# EAGLE schematic turbo_jumper (EAGLE 9.6.2)
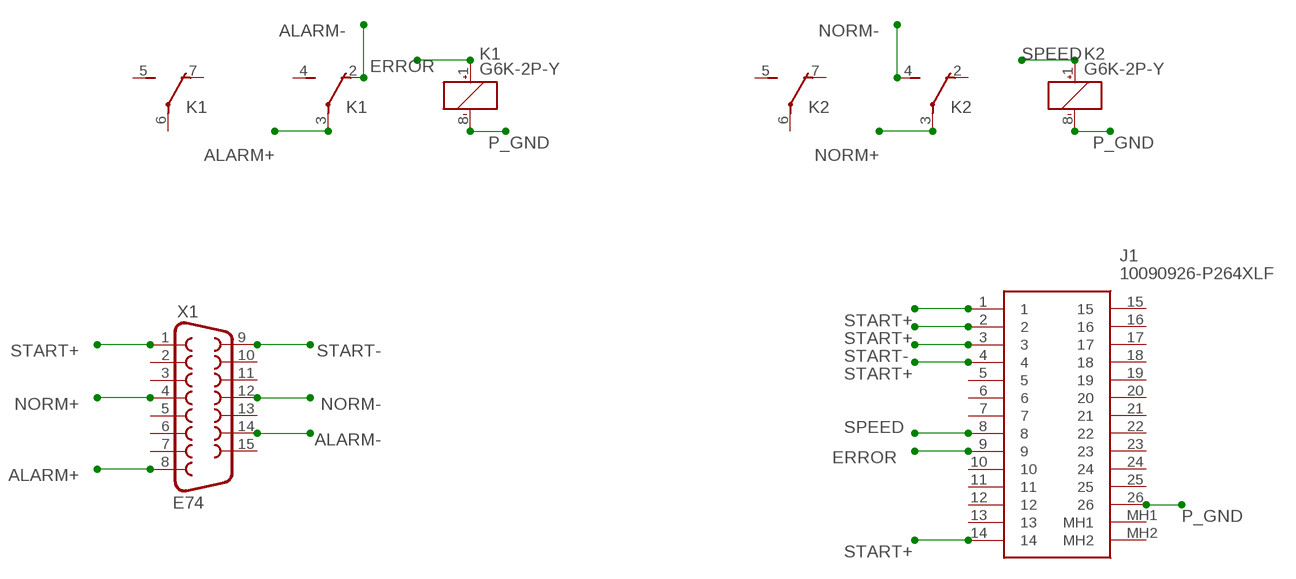
[diagram p0: schematic, sheet 1]

## Parts
J1  10090926-P264XLF  [10090926P264XLF]
K1  G6K-2P-Y  [G6K-2P-Y]
K2  G6K-2P-Y  [G6K-2P-Y]
X1  E74  F15VP  [F15VP]

## Nets
ALARM+: K1.3(2:P) X1.8
ALARM-: K1.2(2:O) X1.14
ERROR: J1.9 K1.1(1:+)
NORM+: K2.3(2:P) X1.4
NORM-: K2.4(2:S) X1.12
P_GND: J1.26 K1.8(1:-) K2.8(1:-)
SPEED: J1.8 K2.1(1:+)
START+: J1.1 J1.2 J1.4 J1.14 X1.1
START-: J1.3 X1.9
Unconnected: J1.5 J1.6 J1.7 J1.10 J1.11 J1.12 J1.13 J1.15 J1.16 J1.17 J1.18 J1.19 J1.20 J1.21 J1.22 J1.23 J1.24 J1.25 J1.MH1 J1.MH2 K1.4(2:S) K1.5(3:S) K1.6(3:P) K1.7(3:O) K2.2(2:O) K2.5(3:S) K2.6(3:P) K2.7(3:O) X1.2 X1.3 X1.5 X1.6 X1.7 X1.10 X1.11 X1.13 X1.15

## Library data of the parts
J1 = 10090926-P264XLF:10090926-P264XLF: 26 Position D-Sub, High Density Plug, Male Pins Connector Source: Datasheet <https://cdn.amphenol-cs.com/media/wysiwyg/files/drawing/10090926.pdf>; DESCRIPTION: 26 Position D-Sub, High Density Plug, Male Pins Connector; HEIGHT: 12.8mm; MANUFACTURER_NAME: Amphenol; MANUFACTURER_PART_NUMBER: 10090926-P264XLF; MOUSER_PART_NUMBER: 649-10090926-P264XLF; MOUSER_PRICE-STOCK: https://www.mouser.co.uk/ProductDetail/Amphenol-FCI/10090926-P264XLF?qs=EnLMdcWnKABFbd55HgNl%252Bg%3D%3D
K1 K2 = relay:G6K: Low Signal Relay oeiwcsnts1.omron.com/.. D20G6K0100.pdf; MF: OMRON COMPONENTS USA; MPN: G6K-2P-Y DC12; OC_FARNELL: 3937276; OC_NEWARK: 34C3464
X1 = con-subd:F15: SUB-D; OC_FARNELL: unknown; OC_NEWARK: unknown

## Net classes
0 default: width 0.356 mm
1 i-current: width 0.356 mm